# EAGLE design schaltung1.2 (EAGLE 5.07)
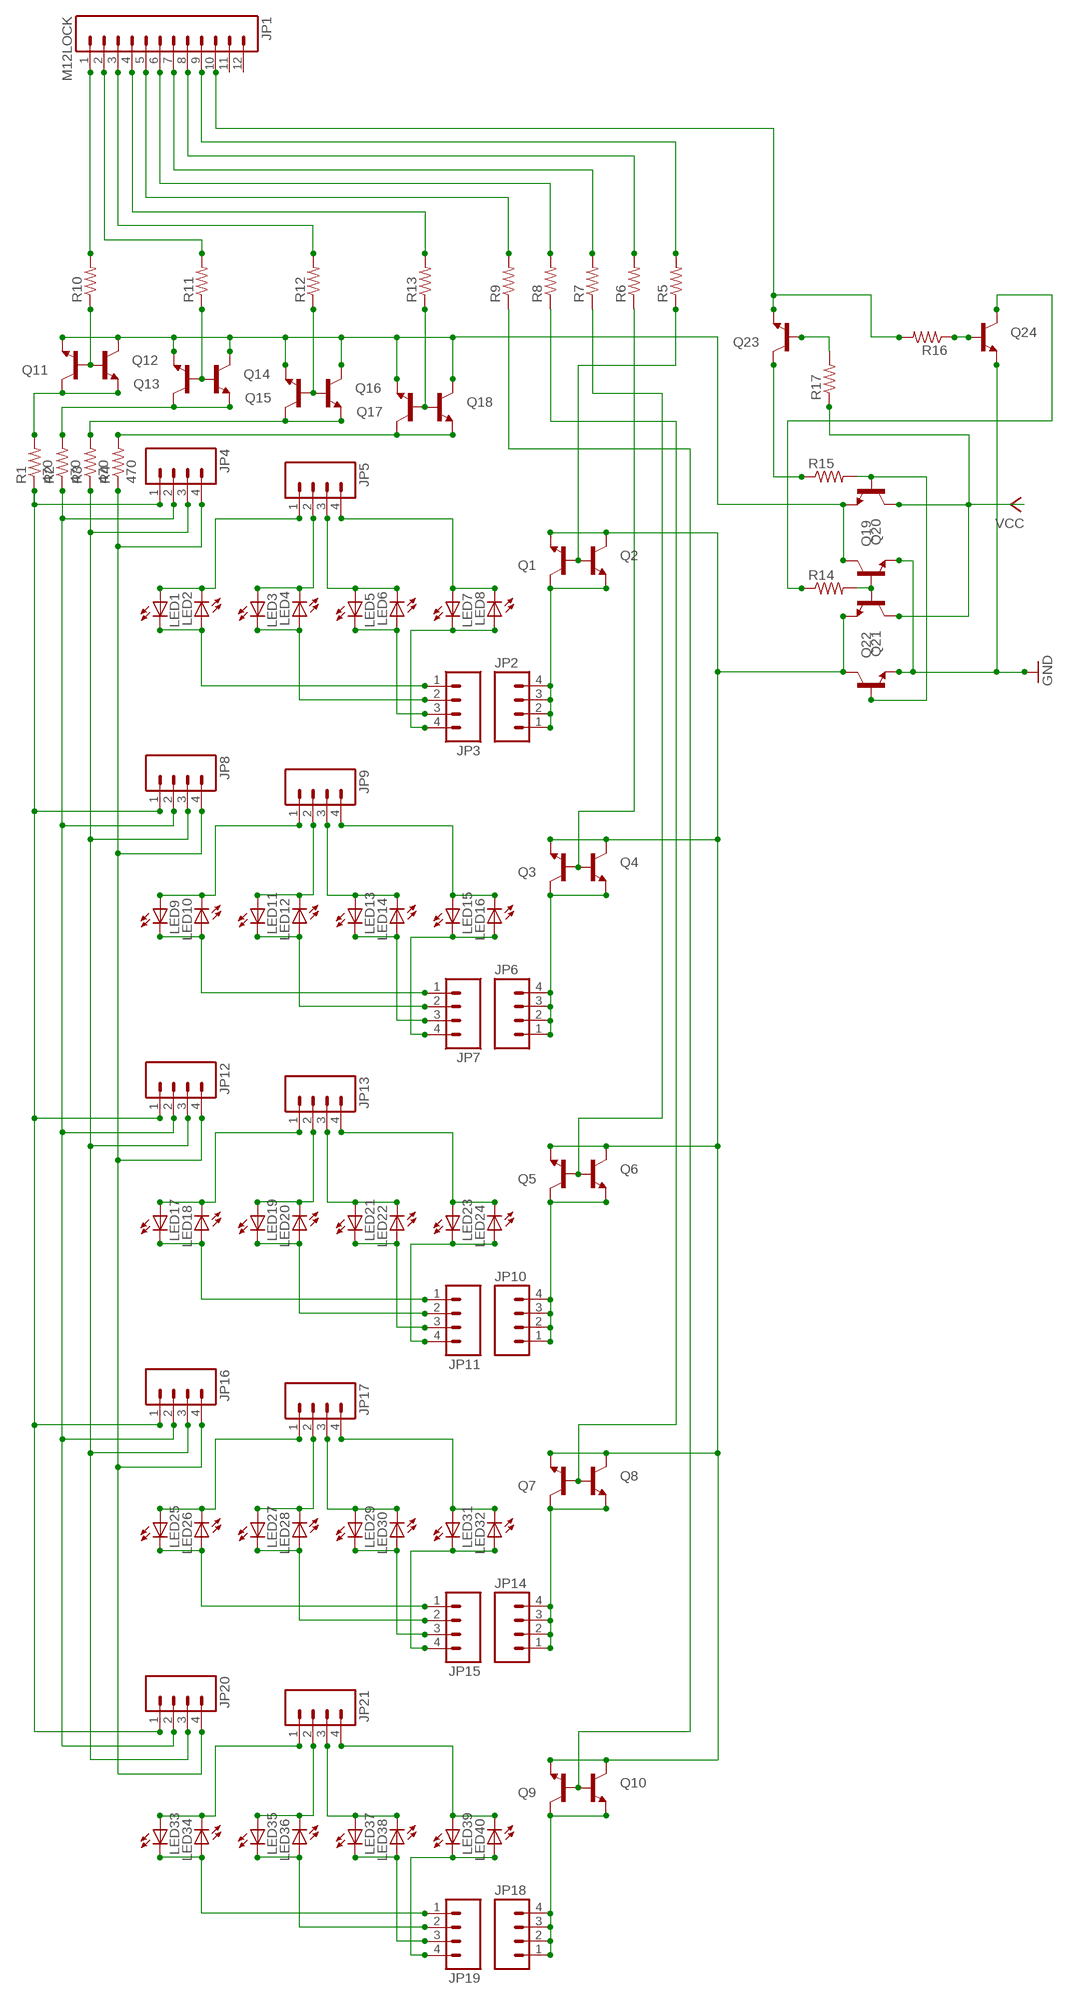
[diagram p0: schematic, sheet 1]

## Parts
JP1  M12LOCK  [1X12_LOCK]
JP2  M04LOCK  [1X04_LOCK]
JP3  M04LOCK  [1X04_LOCK]
JP4  M04LOCK  [1X04_LOCK]
JP5  M04LOCK  [1X04_LOCK]
JP6  M04LOCK  [1X04_LOCK]
JP7  M04LOCK  [1X04_LOCK]
JP8  M04LOCK  [1X04_LOCK]
JP9  M04LOCK  [1X04_LOCK]
JP10  M04LOCK  [1X04_LOCK]
JP11  M04LOCK  [1X04_LOCK]
JP12  M04LOCK  [1X04_LOCK]
JP13  M04LOCK  [1X04_LOCK]
JP14  M04LOCK  [1X04_LOCK]
JP15  M04LOCK  [1X04_LOCK]
JP16  M04LOCK  [1X04_LOCK]
JP17  M04LOCK  [1X04_LOCK]
JP18  M04LOCK  [1X04_LOCK]
JP19  M04LOCK  [1X04_LOCK]
JP20  M04LOCK  [1X04_LOCK]
JP21  M04LOCK  [1X04_LOCK]
LED1  LED5MM  [LED5MM]
LED2  LED5MM  [LED5MM]
LED3  LED5MM  [LED5MM]
LED4  LED5MM  [LED5MM]
LED5  LED5MM  [LED5MM]
LED6  LED5MM  [LED5MM]
LED7  LED5MM  [LED5MM]
LED8  LED5MM  [LED5MM]
LED9  LED5MM  [LED5MM]
LED10  LED5MM  [LED5MM]
LED11  LED5MM  [LED5MM]
LED12  LED5MM  [LED5MM]
LED13  LED5MM  [LED5MM]
LED14  LED5MM  [LED5MM]
LED15  LED5MM  [LED5MM]
LED16  LED5MM  [LED5MM]
LED17  LED5MM  [LED5MM]
LED18  LED5MM  [LED5MM]
LED19  LED5MM  [LED5MM]
LED20  LED5MM  [LED5MM]
LED21  LED5MM  [LED5MM]
LED22  LED5MM  [LED5MM]
LED23  LED5MM  [LED5MM]
LED24  LED5MM  [LED5MM]
LED25  LED5MM  [LED5MM]
LED26  LED5MM  [LED5MM]
LED27  LED5MM  [LED5MM]
LED28  LED5MM  [LED5MM]
LED29  LED5MM  [LED5MM]
LED30  LED5MM  [LED5MM]
LED31  LED5MM  [LED5MM]
LED32  LED5MM  [LED5MM]
LED33  LED5MM  [LED5MM]
LED34  LED5MM  [LED5MM]
LED35  LED5MM  [LED5MM]
LED36  LED5MM  [LED5MM]
LED37  LED5MM  [LED5MM]
LED38  LED5MM  [LED5MM]
LED39  LED5MM  [LED5MM]
LED40  LED5MM  [LED5MM]
Q1  TRANSISTOR_NPNTO92  [TO-92]
Q2  TRANSISTOR_NPNTO92  [TO-92]
Q3  TRANSISTOR_NPNTO92  [TO-92]
Q4  TRANSISTOR_NPNTO92  [TO-92]
Q5  TRANSISTOR_NPNTO92  [TO-92]
Q6  TRANSISTOR_NPNTO92  [TO-92]
Q7  TRANSISTOR_NPNTO92  [TO-92]
Q8  TRANSISTOR_NPNTO92  [TO-92]
Q9  TRANSISTOR_NPNTO92  [TO-92]
Q10  TRANSISTOR_NPNTO92  [TO-92]
Q11  TRANSISTOR_NPNTO92  [TO-92]
Q12  TRANSISTOR_NPNTO92  [TO-92]
Q13  TRANSISTOR_NPNTO92  [TO-92]
Q14  TRANSISTOR_NPNTO92  [TO-92]
Q15  TRANSISTOR_NPNTO92  [TO-92]
Q16  TRANSISTOR_NPNTO92  [TO-92]
Q17  TRANSISTOR_NPNTO92  [TO-92]
Q18  TRANSISTOR_NPNTO92  [TO-92]
Q19  TRANSISTOR_NPNTO92  [TO-92]
Q20  TRANSISTOR_NPNTO92  [TO-92]
Q21  TRANSISTOR_NPNTO92  [TO-92]
Q22  TRANSISTOR_NPNTO92  [TO-92]
Q23  TRANSISTOR_NPNTO92  [TO-92]
Q24  TRANSISTOR_NPNTO92  [TO-92]
R1  470  RESISTORPTH1  [AXIAL-0.3]
R2  470  RESISTORPTH1  [AXIAL-0.3]
R3  470  RESISTORPTH1  [AXIAL-0.3]
R4  470  RESISTORPTH1  [AXIAL-0.3]
R5  RESISTORPTH1  [AXIAL-0.3]
R6  RESISTORPTH1  [AXIAL-0.3]
R7  RESISTORPTH1  [AXIAL-0.3]
R8  RESISTORPTH1  [AXIAL-0.3]
R9  RESISTORPTH1  [AXIAL-0.3]
R10  RESISTORPTH1  [AXIAL-0.3]
R11  RESISTORPTH1  [AXIAL-0.3]
R12  RESISTORPTH1  [AXIAL-0.3]
R13  RESISTORPTH1  [AXIAL-0.3]
R14  RESISTORPTH1  [AXIAL-0.3]
R15  RESISTORPTH1  [AXIAL-0.3]
R16  RESISTORPTH1  [AXIAL-0.3]
R17  RESISTORPTH1  [AXIAL-0.3]

## Nets
GND: Q19.1(E) Q22.1(E) Q24.1(E)
N$2: Q1.2(B) Q2.2(B) R5.P$1
N$3: JP3.1 LED1.K(C) LED2.A
N$5: JP1.1 R10.P$2
N$7: JP2.1 JP2.2 JP2.3 JP2.4 Q1.3(C) Q2.1(E)
N$9: Q3.2(B) Q4.2(B) R6.P$1
N$11: JP3.2 LED3.K(C) LED4.A
N$12: JP3.3 LED5.K(C) LED6.A
N$13: JP3.4 LED7.K(C) LED8.A
N$14: JP4.4 JP8.4 JP12.4 JP16.4 JP20.4 R4.P$1
N$16: JP5.1 LED1.A LED2.K(C)
N$17: JP5.2 LED3.A LED4.K(C)
N$18: JP5.3 LED5.A LED6.K(C)
N$19: JP5.4 LED7.A LED8.K(C)
N$20: JP1.2 R11.P$2
N$21: Q19.2(B) Q21.2(B) R14.P$2
N$24: JP4.2 JP8.2 JP12.2 JP16.2 JP20.2 R2.P$1
N$25: JP6.1 JP6.2 JP6.3 JP6.4 Q3.3(C) Q4.1(E)
N$26: JP7.1 LED9.K(C) LED10.A
N$27: JP7.2 LED11.K(C) LED12.A
N$29: Q11.2(B) Q12.2(B) R10.P$1
N$30: Q11.3(C) Q12.1(E) R1.P$2
N$31: Q13.2(B) Q14.2(B) R11.P$1
N$32: Q13.3(C) Q14.1(E) R2.P$2
N$33: JP7.3 LED13.K(C) LED14.A
N$34: Q15.2(B) Q16.2(B) R12.P$1
N$35: Q15.3(C) Q16.1(E) R3.P$2
N$36: JP7.4 LED15.K(C) LED16.A
N$37: JP9.1 LED9.A LED10.K(C)
N$38: Q17.2(B) Q18.2(B) R13.P$1
N$39: Q17.3(C) Q18.1(E) R4.P$2
N$40: Q20.2(B) Q22.2(B) R15.P$2
N$41: JP9.2 LED11.A LED12.K(C)
N$42: Q24.2(B) R16.P$1
N$43: Q23.2(B) R17.P$2
N$45: Q11.1(E) Q12.3(C) Q13.1(E) Q14.3(C) Q15.1(E) Q16.3(C) Q17.1(E) Q18.3(C) Q19.3(C) Q20.1(E)
N$46: JP1.10 Q23.1(E) R16.P$2
N$47: Q23.3(C) R15.P$1
N$48: JP1.3 R12.P$2
N$49: Q24.3(C) R14.P$1
N$50: JP1.4 R13.P$2
N$51: JP1.5 R9.P$2
N$52: JP1.6 R8.P$2
N$53: JP1.7 R7.P$2
N$54: JP1.8 R6.P$2
N$55: JP1.9 R5.P$2
N$56: JP9.3 LED13.A LED14.K(C)
N$57: JP9.4 LED15.A LED16.K(C)
N$62: Q5.2(B) Q6.2(B) R7.P$1
N$64: JP10.1 JP10.2 JP10.3 JP10.4 Q5.3(C) Q6.1(E)
N$65: JP11.1 LED17.K(C) LED18.A
N$66: JP11.2 LED19.K(C) LED20.A
N$67: JP11.3 LED21.K(C) LED22.A
N$68: JP11.4 LED23.K(C) LED24.A
N$69: JP13.1 LED17.A LED18.K(C)
N$70: JP13.2 LED19.A LED20.K(C)
N$71: JP13.3 LED21.A LED22.K(C)
N$72: JP13.4 LED23.A LED24.K(C)
N$77: Q7.2(B) Q8.2(B) R8.P$1
N$78: Q1.1(E) Q2.3(C) Q3.1(E) Q4.3(C) Q5.1(E) Q6.3(C) Q7.1(E) Q8.3(C) Q9.1(E) Q10.3(C) Q21.1(E) Q22.3(C)
N$79: JP14.1 JP14.2 JP14.3 JP14.4 Q7.3(C) Q8.1(E)
N$80: JP15.1 LED25.K(C) LED26.A
N$81: JP15.2 LED27.K(C) LED28.A
N$82: JP15.3 LED29.K(C) LED30.A
N$83: JP15.4 LED31.K(C) LED32.A
N$84: JP17.1 LED25.A LED26.K(C)
N$85: JP17.2 LED27.A LED28.K(C)
N$86: JP17.3 LED29.A LED30.K(C)
N$87: JP17.4 LED31.A LED32.K(C)
N$88: JP4.1 JP8.1 JP12.1 JP16.1 JP20.1 R1.P$1
N$89: JP4.3 JP8.3 JP12.3 JP16.3 JP20.3 R3.P$1
N$90: Q9.2(B) Q10.2(B) R9.P$1
N$92: JP18.1 JP18.2 JP18.3 JP18.4 Q9.3(C) Q10.1(E)
N$93: JP19.1 LED33.K(C) LED34.A
N$94: JP19.2 LED35.K(C) LED36.A
N$95: JP19.3 LED37.K(C) LED38.A
N$96: JP19.4 LED39.K(C) LED40.A
N$97: JP21.1 LED33.A LED34.K(C)
N$98: JP21.2 LED35.A LED36.K(C)
N$99: JP21.3 LED37.A LED38.K(C)
N$100: JP21.4 LED39.A LED40.K(C)
VCC: Q20.3(C) Q21.3(C) R17.P$1
Unconnected: JP1.11 JP1.12

## Library data of the parts
JP1 = SparkFun:M12: Header 12 Standard 12-pin 0.1" header. Use with straight break away headers (SKU : PRT-00116), right angle break away headers (PRT-00553), swiss pins (PRT-00743), machine pins (PRT-00117), and female headers (PRT-00115).
JP2-JP21 = SparkFun:M04: Header 4 Standard 4-pin 0.1" header. Use with straight break away headers (SKU : PRT-00116), right angle break away headers (PRT-00553), swiss pins (PRT-00743), machine pins (PRT-00117), and female headers (PRT-00115). Molex polarized connector foot print use with SKU : PRT-08231 with associated crimp pins and housings.
LED1-LED40 = SparkFun:LED: LEDs Standard schematic elements and footprints for 5mm, 3mm, 1206, and 0603 sized LEDs. 5mm - Spark Fun Electronics SKU : COM-00529 (and others)
Q1-Q24 = SparkFun:TRANSISTOR_NPN: Transistor NPN BJT configuration in SOT23 package. MMBT2222 is the common NPN we use. Double check BCE configuration again layout.
R1-R17 = SparkFun:RESISTOR: Resistor Basic schematic elements and footprints for 0603, 1206, and PTH 1/10th watt (small) resistors.

## Board
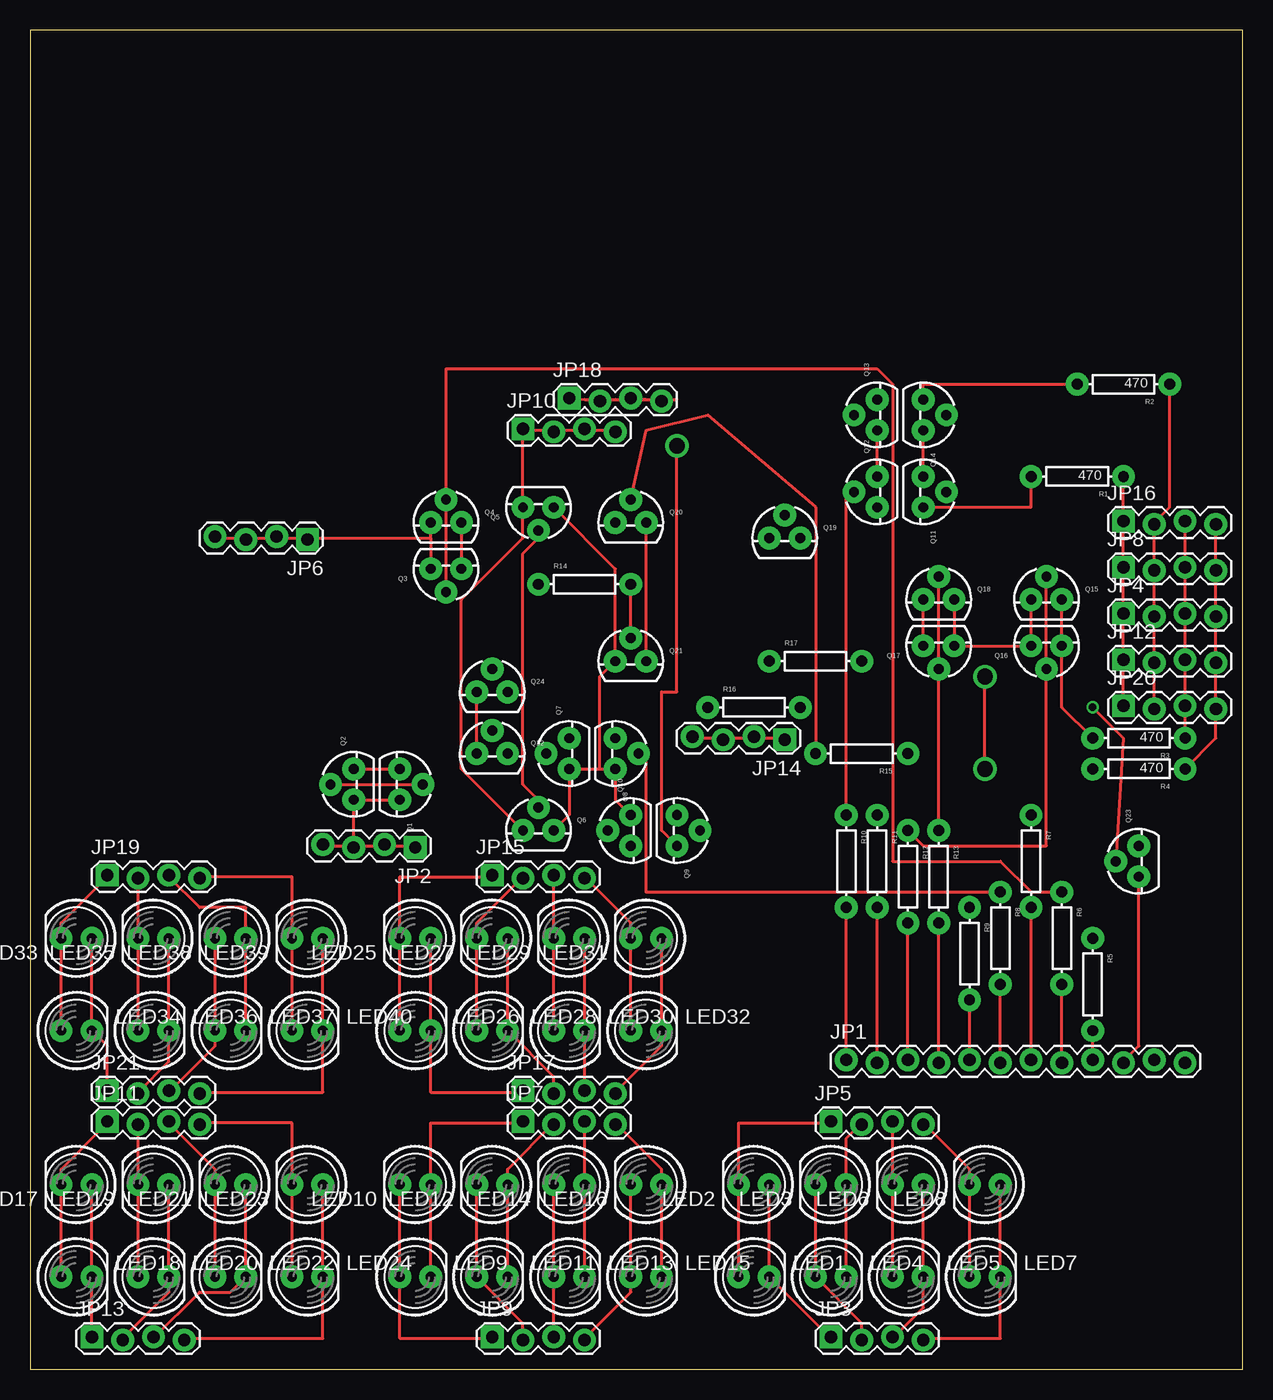
[diagram p1: board, top side]
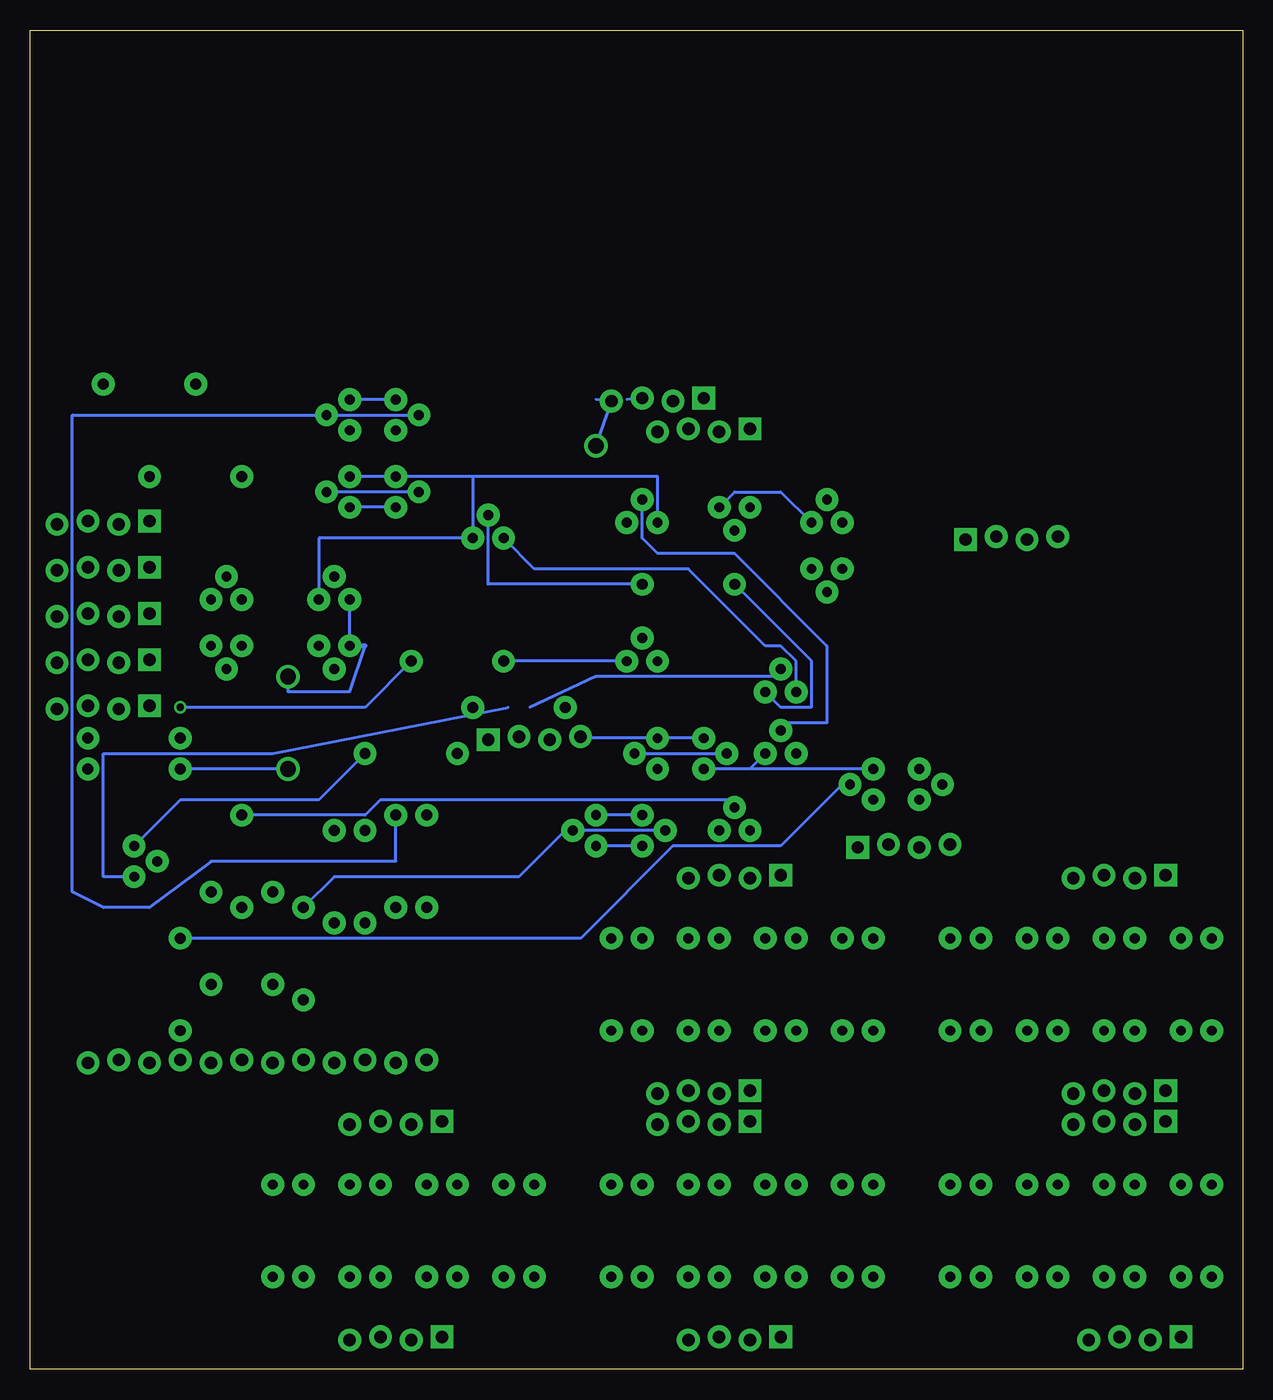
[diagram p2: board, bottom side, seen from below]

Size 100 x 110.48 mm. Coordinates in mm from the lower left corner, seen from the top.
Outline: 0,0 100,0 100,110.48 0,110.48 0,0
Copper layers (1*16): Top 0.035mm / dielectric 1.5mm / Bottom 0.035mm
Design rules "default": minimum track width 10mil, minimum drill 24mil, track to track 8mil, track to pad 8mil, pad to pad 8mil, via to via 8mil, smd to smd 8mil, copper to edge 40mil, drill to drill 8mil, minimum pad ring 10mil, minimum via ring 8mil, stop-mask expansion 4mil, vias tented up to drill 0mil, thermal gap 10mil

### Footprints (pad centres in the part's own frame; a part is rotated, then mirrored left to right if it is on the bottom)
1X12_LOCK = drill 1.016 pad 1.88 round: 1 0,0.127; 2 2.54,-0.127; 3 5.08,0.127; 4 7.62,-0.127; 5 10.16,0.127; 6 12.7,-0.127; 7 15.24,0.127; 8 17.78,-0.127; 9 20.32,0.127; 10 22.86,-0.127; 11 25.4,0.127; 12 27.94,-0.127
1X04_LOCK = drill 1.016 pad 1.88 square: 1 0,0.127 | drill 1.016 pad 1.88 round: 2 2.54,-0.127; 3 5.08,0.127; 4 7.62,-0.127
LED5MM = drill 0.813 pad 1.88 round: A -1.27,0; K 1.27,0
TO-92 = drill 0.813 pad 1.88 round: 1 -1.27,0; 2 0,1.905; 3 1.27,0
AXIAL-0.3 = drill 0.9 pad 1.88 round: P$1 -3.81,0; P$2 3.81,0

### Placement (x,y rotation side)
JP1  67.31,25.4 0 top
JP2  31.75,43.18 180 top
JP3  66.04,2.54 0 top
JP4  90.17,62.23 0 top
JP5  66.04,20.32 0 top
JP6  22.86,68.58 180 top
JP7  40.64,20.32 0 top
JP8  90.17,66.04 0 top
JP9  38.1,2.54 0 top
JP10  40.64,77.47 0 top
JP11  6.35,20.32 0 top
JP12  90.17,58.42 0 top
JP13  5.08,2.54 0 top
JP14  62.23,52.07 180 top
JP15  38.1,40.64 0 top
JP16  90.17,69.85 0 top
JP17  40.64,22.86 0 top
JP18  44.45,80.01 0 top
JP19  6.35,40.64 0 top
JP20  90.17,54.61 0 top
JP21  6.35,22.86 0 top
LED1  59.69,7.62 0 top
LED2  59.69,15.24 180 top
LED3  66.04,15.24 180 top
LED4  66.04,7.62 0 top
LED5  72.39,7.62 0 top
LED6  72.39,15.24 180 top
LED7  78.74,7.62 0 top
LED8  78.74,15.24 180 top
LED9  31.75,7.62 0 top
LED10  31.75,15.24 180 top
LED11  38.1,7.62 0 top
LED12  38.1,15.24 180 top
LED13  44.45,7.62 0 top
LED14  44.45,15.24 180 top
LED15  50.8,7.62 0 top
LED16  50.8,15.24 180 top
LED17  3.81,15.24 180 top
LED18  3.81,7.62 0 top
LED19  10.16,15.24 180 top
LED20  10.16,7.62 0 top
LED21  16.51,15.24 180 top
LED22  16.51,7.62 0 top
LED23  22.86,15.24 180 top
LED24  22.86,7.62 0 top
LED25  31.75,35.56 180 top
LED26  31.75,27.94 0 top
LED27  38.1,35.56 180 top
LED28  38.1,27.94 0 top
LED29  44.45,35.56 180 top
LED30  44.45,27.94 0 top
LED31  50.8,35.56 180 top
LED32  50.8,27.94 0 top
LED33  3.81,35.56 180 top
LED34  3.81,27.94 0 top
LED35  10.16,35.56 180 top
LED36  10.16,27.94 0 top
LED37  16.51,27.94 0 top
LED38  16.51,35.56 180 top
LED39  22.86,35.56 180 top
LED40  22.86,27.94 0 top
Q1  30.48,48.26 270 top
Q2  26.67,48.26 90 top
Q3  34.29,66.04 180 top
Q4  34.29,69.85 0 top
Q5  41.91,71.12 180 top
Q6  41.91,44.45 0 top
Q7  44.45,50.8 90 top
Q8  48.26,50.8 270 top
Q9  53.34,44.45 270 top
Q10  49.53,44.45 90 top
Q11  73.66,72.39 270 top
Q12  69.85,72.39 90 top
Q13  69.85,78.74 90 top
Q14  73.66,78.74 270 top
Q15  83.82,63.5 0 top
Q16  83.82,59.69 180 top
Q17  74.93,59.69 180 top
Q18  74.93,63.5 0 top
Q19  62.23,68.58 0 top
Q20  49.53,69.85 0 top
Q21  49.53,58.42 0 top
Q22  38.1,50.8 0 top
Q23  91.44,41.91 90 top
Q24  38.1,55.88 0 top
R1  86.36,73.66 180 top
R2  90.17,81.28 180 top
R3  91.44,52.07 180 top
R4  91.44,49.53 180 top
R5  87.63,31.75 270 top
R6  85.09,35.56 270 top
R7  82.55,41.91 270 top
R8  80.01,35.56 270 top
R9  77.47,34.29 270 top
R10  67.31,41.91 270 top
R11  69.85,41.91 270 top
R12  72.39,40.64 270 top
R13  74.93,40.64 270 top
R14  45.72,64.77 0 top
R15  68.58,50.8 180 top
R16  59.69,54.61 0 top
R17  64.77,58.42 0 top

### Tracks (layer width: path | path; a pad name or v marks a point on that pad's centre or on a via)
GND
  Top 0.254: Q22.1 Q24.1
  Bottom 0.254: Q19.1 58.42,66.04 45.72,66.04 39.37,59.69 38.1,59.69 36.83,58.42 Q24.1
N$2
  Top 0.254: Q2.2 Q1.2
  Bottom 0.254: R5.P$1 54.61,35.56 46.99,43.18 38.1,43.18 33.02,48.26 Q1.2
N$3
  Top 0.254: JP3.1 66.04,2.54 LED1.K LED2.A
N$5
  Top 0.254: R10.P$2 JP1.1 67.31,25.4
N$7
  Top 0.254: Q1.3 Q2.1 26.67,43.18 | 26.67,43.18 24.13,43.18 JP2.4 | 26.67,43.18 29.21,43.18 | 29.21,43.18 31.75,43.18 JP2.1 | 29.21,43.18 JP2.2 | 26.67,43.18 JP2.3
N$9
  Top 0.254: Q3.2 Q4.2 34.29,82.55 69.85,82.55 71.12,81.28 71.12,41.91 80.01,41.91 82.55,39.37 R6.P$1
N$11
  Top 0.254: JP3.2 68.58,3.81 LED4.A LED3.K
N$12
  Top 0.254: JP3.3 71.12,2.54 73.66,5.08 LED5.K LED6.A
N$13
  Top 0.254: JP3.4 73.66,2.54 80.01,2.54 LED7.K LED8.A
N$14
  Top 0.254: 97.79,69.85 JP16.4 97.79,66.04 JP8.4 97.79,62.23 JP4.4 97.79,58.42 JP12.4 97.79,54.61 JP20.4 97.79,52.07 R4.P$1
N$16
  Top 0.254: LED1.A LED2.K 58.42,20.32 66.04,20.32 JP5.1
N$17
  Top 0.254: LED4.K LED3.A 67.31,19.05 68.58,20.32 JP5.2
N$18
  Top 0.254: LED5.A LED6.K JP5.3
N$19
  Top 0.254: LED7.A LED8.K 77.47,16.51 73.66,20.32 JP5.4
N$20
  Top 0.254: JP1.2 R11.P$2
N$21
  Top 0.254: Q21.2 R14.P$2
  Bottom 0.254: R14.P$2 62.23,64.77 Q19.2
N$24
  Top 0.254: R2.P$1 93.98,71.12 92.71,69.85 JP16.2 JP8.2 JP4.2 JP12.2 JP20.2
N$25
  Top 0.254: 33.02,68.58 Q4.1 | 33.02,68.58 Q3.3 | 17.78,68.58 15.24,68.58 JP6.4 | 20.32,68.58 22.86,68.58 | 17.78,68.58 20.32,68.58 | 17.78,68.58 JP6.3 | 20.32,68.58 JP6.2 | 22.86,68.58 33.02,68.58 | 22.86,68.58 JP6.1
N$26
  Top 0.254: LED9.K LED10.A 33.02,20.32 40.64,20.32 JP7.1
N$27
  Top 0.254: LED11.K LED12.A 39.37,16.51 43.18,20.32 JP7.2
N$29
  Top 0.254: R10.P$1 67.31,72.39 Q12.2
  Bottom 0.254: Q12.2 Q11.2
N$30
  Top 0.254: Q11.3 82.55,71.12 R1.P$2
  Bottom 0.254: Q12.1 Q11.3
N$31
  Bottom 0.254: R11.P$1 69.85,41.91 85.09,41.91 90.17,38.1 93.98,38.1 96.52,39.37 96.52,78.74 Q14.2 Q13.2
N$32
  Top 0.254: Q14.1 73.66,81.28 R2.P$2
  Bottom 0.254: Q13.3 Q14.1
N$33
  Top 0.254: LED13.K LED14.A JP7.3
N$34
  Top 0.254: R12.P$1 73.66,43.18 83.82,43.18 Q16.2 Q15.2
N$35
  Top 0.254: Q15.3 Q16.1 85.09,54.61 R3.P$2
N$36
  Top 0.254: LED15.K LED16.A 52.07,16.51 48.26,20.32 JP7.4
N$37
  Top 0.254: LED10.K LED9.A 30.48,2.54 38.1,2.54 JP9.1
N$38
  Top 0.254: R13.P$1 Q17.2 Q18.2
N$39  (via drill 1.3)
  Top 0.254: Q17.3 Q18.1 | v78.74,49.53 v78.74,57.15
  Bottom 0.254: v78.74,49.53 R4.P$2 | Q17.3 Q18.1 | 72.39,59.69 73.66,55.88 78.74,55.88 v78.74,57.15
  Bottom 0.406: 72.39,59.69 Q17.3
N$40
  Top 0.254: R15.P$2 64.77,71.12 55.88,78.74 50.8,77.47 Q20.2
  Bottom 0.254: Q22.2 38.1,53.34 34.29,53.34 34.29,59.69 41.91,67.31 48.26,67.31 49.53,68.58 Q20.2
N$41
  Top 0.254: JP9.2 40.64,3.81 LED11.A LED12.K
N$42
  Bottom 0.254: 58.79,54.61 53.34,57.15 38.1,57.15 Q24.2
N$43  (via drill 0.61)
  Top 0.254: v87.63,54.61 90.17,52.07 Q23.2
  Bottom 0.254: R17.P$2 72.39,54.61 v87.63,54.61
N$45
  Top 0.254: Q18.3 Q17.1 Q16.3 Q15.1 | Q11.1 Q14.3 | Q12.3 Q13.1
  Bottom 0.254: Q20.1 48.26,73.66 63.5,73.66 | 63.5,73.66 Q12.3 Q11.1 | 63.5,73.66 Q19.3 76.2,68.58 Q18.3
N$46
  Top 0.254: Q23.1 91.44,26.67 90.17,25.4 JP1.10
  Bottom 0.254: 60.59,54.61 80.01,50.8 93.98,50.8 93.98,40.64 Q23.1
N$47
  Bottom 0.254: R15.P$1 76.2,46.99 87.63,46.99 Q23.3
N$48
  Top 0.254: R12.P$2 JP1.3 72.39,25.4
N$49
  Bottom 0.254: Q24.3 38.1,54.61 35.56,54.61 35.56,58.42 R14.P$1
N$50
  Top 0.254: JP1.4 R13.P$2
N$51
  Top 0.254: R9.P$2 JP1.5 77.47,25.4
N$52
  Top 0.254: JP1.6 R8.P$2
N$53
  Top 0.254: R7.P$2 JP1.7 82.55,25.4
N$54
  Top 0.254: JP1.8 R6.P$2
N$55
  Top 0.254: R5.P$2 JP1.9 87.63,25.4
N$56
  Top 0.254: 43.18,2.54 JP9.3 LED13.A LED14.K
N$57
  Top 0.254: JP9.4 45.72,2.54 49.53,6.35 LED15.A LED16.K
N$62
  Top 0.254: Q6.2 41.91,46.99 40.64,48.26 40.64,67.31 41.91,68.58 Q5.2
  Bottom 0.254: R7.P$1 72.39,45.72 71.12,46.99 41.91,46.99 Q6.2
N$64
  Top 0.254: 40.64,77.47 43.18,77.47 | 43.18,77.47 45.72,77.47 | 43.18,77.47 JP10.2 | 45.72,77.47 48.26,77.47 JP10.4 | 45.72,77.47 JP10.3 | Q6.1 35.56,49.53 35.56,63.5 40.64,68.58 Q5.3 40.64,77.47 | 40.64,77.47 JP10.1
N$65
  Top 0.254: LED18.A LED17.K 2.54,16.51 6.35,20.32 JP11.1
N$66
  Top 0.254: LED20.A LED19.K JP11.2 8.89,20.32
N$67
  Top 0.254: LED22.A LED21.K 15.24,16.51 11.43,20.32 JP11.3
N$68
  Top 0.254: LED24.A LED23.K 21.59,20.32 13.97,20.32 JP11.4
N$69
  Top 0.254: 5.08,2.54 JP13.1 LED18.K LED17.A
N$70
  Top 0.254: JP13.2 7.62,2.54 11.43,6.35 LED20.K LED19.A
N$71
  Top 0.254: JP13.3 10.16,2.54 13.97,6.35 16.51,6.35 LED22.K LED21.A
N$72
  Top 0.254: JP13.4 12.7,2.54 24.13,2.54 LED24.K LED23.A
N$77
  Top 0.254: R8.P$1 50.8,39.37 50.8,50.8 Q8.2
  Bottom 0.254: Q8.2 Q7.2
N$78
  Top 0.254: Q4.3 Q3.1 | Q2.3 Q1.1 | Q6.3 44.45,45.72 Q7.1 46.99,49.53 | 46.99,49.53 Q8.3 48.26,46.99 Q10.3 | 46.99,49.53 46.99,57.15 Q21.1 48.26,66.04 Q5.1
  Bottom 0.254: Q10.3 Q9.1 | 40.64,49.53 Q22.3 | 40.64,49.53 Q7.1 | Q1.1 40.64,49.53 | Q4.3 38.1,72.39 41.91,72.39 Q5.1
N$79
  Top 0.254: 57.15,52.07 54.61,52.07 JP14.4 | 57.15,52.07 59.69,52.07 | 57.15,52.07 JP14.3 | 59.69,52.07 62.23,52.07 JP14.1 | 59.69,52.07 JP14.2
  Bottom 0.254: Q7.3 Q8.1 54.61,52.07 JP14.4
N$80
  Top 0.254: LED26.A LED25.K 30.48,40.64 38.1,40.64 JP15.1
N$81
  Top 0.254: LED28.A LED27.K 36.83,36.83 40.64,40.64 JP15.2
N$82
  Top 0.254: LED30.A LED29.K JP15.3
N$83
  Top 0.254: LED32.A LED31.K 49.53,36.83 45.72,40.64 JP15.4
N$84
  Top 0.254: LED25.A LED26.K 33.02,22.86 40.64,22.86 JP17.1
N$85
  Top 0.254: JP17.2 43.18,24.13 LED28.K LED27.A
N$86
  Top 0.254: 45.72,22.86 JP17.3 LED30.K LED29.A
N$87
  Top 0.254: JP17.4 48.26,22.86 52.07,26.67 LED32.K LED31.A
N$88
  Top 0.254: 90.17,54.61 JP20.1 JP12.1 JP4.1 JP8.1 JP16.1 R1.P$1
N$89
  Top 0.254: JP16.3 JP8.3 95.25,66.04 JP4.3 95.25,62.23 JP12.3 95.25,58.42 JP20.3 95.25,54.61 R3.P$1
N$90
  Bottom 0.254: Q10.2 Q9.2 55.88,44.45 59.69,40.64 74.93,40.64 R9.P$1
N$92  (via drill 1.3)
  Top 0.254: 48.26,80.01 45.72,80.01 JP18.1 | 50.8,80.01 53.34,80.01 JP18.4 | 48.26,80.01 50.8,80.01 | 48.26,80.01 JP18.2 | 50.8,80.01 JP18.3 | Q9.3 52.07,44.45 52.07,55.88 53.34,55.88 v53.34,76.2
  Bottom 0.254: Q10.1 Q9.3 | 53.34,80.01 JP18.4 v53.34,76.2 | JP18.3 50.8,80.01
N$93
  Top 0.254: LED34.A LED33.K 2.54,36.83 6.35,40.64 JP19.1
N$94
  Top 0.254: LED36.A LED35.K JP19.2 8.89,40.64
N$95
  Top 0.254: LED37.K LED38.A 17.78,38.1 13.97,38.1 11.43,40.64 JP19.3
N$96
  Top 0.254: LED40.A LED39.K 21.59,40.64 13.97,40.64 JP19.4
N$97
  Top 0.254: 6.35,22.86 JP21.1 6.35,26.67 LED34.K LED33.A
N$98
  Top 0.254: JP21.2 8.89,22.86 11.43,25.4 LED36.K LED35.A
N$99
  Top 0.254: JP21.3 11.43,22.86 15.24,26.67 LED37.A LED38.K
N$100
  Top 0.254: JP21.4 13.97,22.86 24.13,22.86 LED40.K LED39.A
VCC
  Top 0.254: Q21.3 Q20.3
  Bottom 0.254: Q21.3 R17.P$1